# Altium project casio.PrjPcb
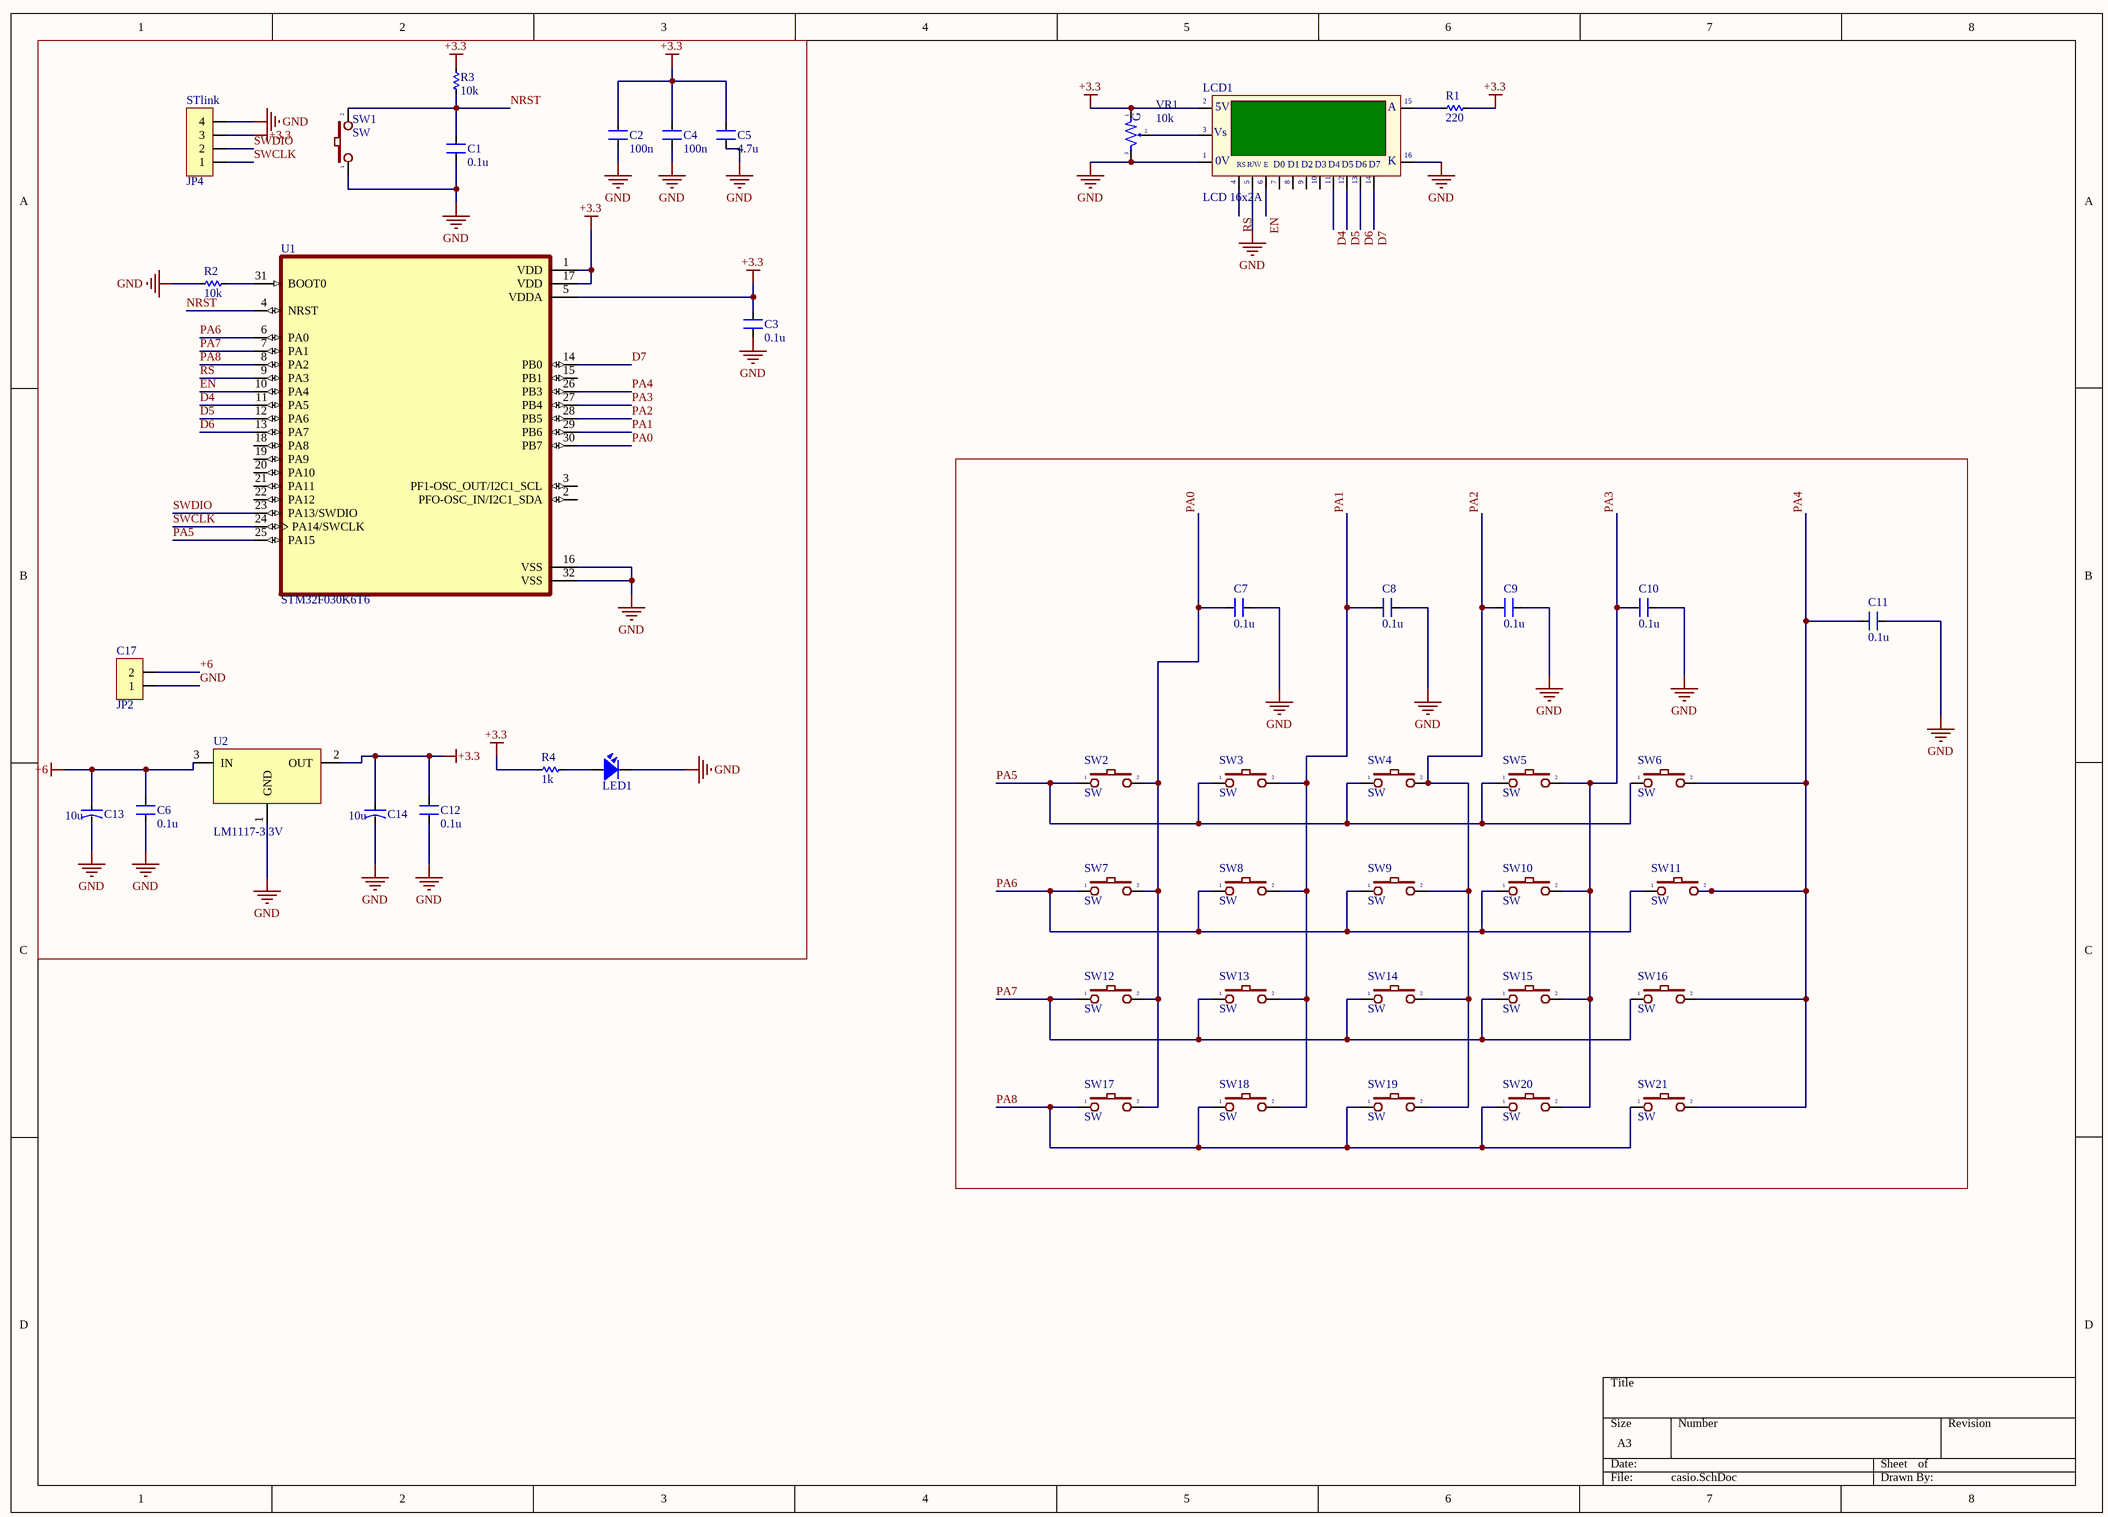
[diagram p0: casio.SchDoc]
1 sheet, 46 parts. Net scope: global (net labels, ports and power ports of the same name join across sheets).
Board file: casio_final.PcbDoc

## Sheet casio.SchDoc
size A3; SheetNumber: 1; SheetTotal: 1

### Parts
C1  0.1u  [CN-SMD-0805]
C2  100n  [CN-SMD-0805]
C3  0.1u  [CN-SMD-0805]
C4  100n  [CN-SMD-0805]
C5  4.7u  [CN-SMD-0805]
C6  0.1u  [CN-SMD-0805]
C7  0.1u  [CN-SMD-0805]
C8  0.1u  [CN-SMD-0805]
C9  0.1u  [CN-SMD-0805]
C10  0.1u  [CN-SMD-0805]
C11  0.1u  [CN-SMD-0805]
C12  0.1u  [CN-SMD-0805]
C13  10u  [CAP-ALU-SMD-5.5x5.5]
C14  10u  [CAP-ALU-SMD-5.5x5.5]
C17  JP2  [JP2-D1T]
LCD1  LCD 16x2A  [LCD16X2]
LED1  LED  [LED-0805-Red]  (value not drawn)
R1  220  [RES-SMD-0805]
R2  10k  [RES-SMD-0805]
R3  10k  [RES-SMD-0805]
R4  1k  [RES-SMD-0805]
STlink  JP4  [JP4-C1T]
SW1  SW  [SW1-SMD]
SW2  SW  [SW1-DIP-12x12x8-Black]
SW3  SW  [SW1-DIP-12x12x8-Black]
SW4  SW  [SW1-DIP-12x12x8-Black]
SW5  SW  [SW1-DIP-12x12x8-Black]
SW6  SW  [SW1-DIP-12x12x8-Black]
SW7  SW  [SW1-DIP-12x12x8-Black]
SW8  SW  [SW1-DIP-12x12x8-Black]
SW9  SW  [SW1-DIP-12x12x8-Black]
SW10  SW  [SW1-DIP-12x12x8-Black]
SW11  SW  [SW1-DIP-12x12x8-Black]
SW12  SW  [SW1-DIP-12x12x8-Black]
SW13  SW  [SW1-DIP-12x12x8-Black]
SW14  SW  [SW1-DIP-12x12x8-Black]
SW15  SW  [SW1-DIP-12x12x8-Black]
SW16  SW  [SW1-DIP-12x12x8-Black]
SW17  SW  [SW1-DIP-12x12x8-Black]
SW18  SW  [SW1-DIP-12x12x8-Black]
SW19  SW  [SW1-DIP-12x12x8-Black]
SW20  SW  [SW1-DIP-12x12x8-Black]
SW21  SW  [SW1-DIP-12x12x8-Black]
U1  STM32F030K6T6  [QFP80P900X900X160-32N]
U2  LM1117-3.3V  [SOT223]
VR1  10k  [VR-S2]

### Nets
+3.3: C2.1 C3.1 C4.1 C5.1 C12.1 C14.1 LCD1.2(VDD) R1.1 R3.2 R4.2 STlink.3 U1.1(VDD) U1.5(VDDA) U1.17(VDD) U2.2(OUT) VR1.1
+6: C6.1 C13.1 C17.2 U2.3(IN)
GND: C1.2 C2.2 C3.2 C4.2 C5.2 C6.2 C7.2 C8.2 C9.2 C10.2 C11.2 C12.2 C13.2 C14.2 C17.1 LCD1.1(GND) LCD1.5(R/~{W}) LCD1.16(K) LED1.2 R2.2 STlink.4 SW1.1 U1.16(VSS) U1.32(VSS) U2.1(GND) VR1.3
D4: LCD1.11(D4) U1.11(PA5)
D5: LCD1.12(D5) U1.12(PA6)
D6: LCD1.13(D6) U1.13(PA7)
D7: LCD1.14(D7) U1.14(PB0)
EN: LCD1.6(~{EN}) U1.10(PA4)
NRST: C1.1 R3.1 SW1.2 U1.4(NRST)
PA0: C7.1 SW2.2 SW7.2 SW12.2 SW17.2 U1.30(PB7)
PA1: C8.1 SW3.2 SW8.2 SW13.2 SW18.2 U1.29(PB6)
PA2: C9.1 SW4.2 SW9.2 SW14.2 SW19.2 U1.28(PB5)
PA3: C10.1 SW5.2 SW10.2 SW15.2 SW20.2 U1.27(PB4)
PA4: C11.1 SW6.2 SW11.2 SW16.2 SW21.2 U1.26(PB3)
PA5: SW2.1 SW3.1 SW4.1 SW5.1 SW6.1 U1.25(PA15)
PA6: SW7.1 SW8.1 SW9.1 SW10.1 SW11.1 U1.6(PA0)
PA7: SW12.1 SW13.1 SW14.1 SW15.1 SW16.1 U1.7(PA1)
PA8: SW17.1 SW18.1 SW19.1 SW20.1 SW21.1 U1.8(PA2)
RS: LCD1.4(RS) U1.9(PA3)
SWCLK: STlink.1 U1.24(PA14/SWCLK)
SWDIO: STlink.2 U1.23(PA13/SWDIO)
NetLCD1_3: LCD1.3(VEE) VR1.2
NetLCD1_15: LCD1.15(A) R1.2
NetLED1_1: LED1.1 R4.1
NetR2_1: R2.1 U1.31(BOOT0)

Not connected (* = marked no-connect by the designer): LCD1 7(D0) 8(D1) 9(D2) 10(D3); U1 2(PFO-OSC_IN/I2C1_SDA) 3(PF1-OSC_OUT/I2C1_SCL) 15(PB1) 18(PA8) 19(PA9) 20(PA10) 21(PA11) 22(PA12)

### Notes on the sheet
- (in symbol LCD16x2A) 5V; Vs; |; 0V; R/W; E
- (in symbol VR-S) G

### Library data of the parts
C1-C12 = CN: Value: 33pF
C13 C14 = CN-SMD: Polarized Capacitor (Axial); Published: 8-Jun-2000; LatestRevisionDate: 17-Jul-2002; LatestRevisionNote: Re-released for DXP Platform.; PackageReference: POLAR0.8; Publisher: Altium Limited
C17 = JP2: WR-PHD 2.54 mm Angled Socket Header; Manufacturer: W¨¹rth Elektronik eiSos GmbH; partNo: 613002143121; ComponentLink1 Description: Manufacturer; ComponentLink2 Description: Datasheet; NoPins: 02; Created Date: 29 March 2013; ComponentLink1URL: http://www.we-online.com; ComponentLink2URL: http://katalog.we-online.de/em/datasheet/6130xx143121.pdf; Created by: Karrer Zheng
LCD1 = LCD16x2A: LCD dipslay 16 char, 2 line; Value: LCD16x2A
LED1 = LED SMD: Value: LED 3 - 5 ly 2 Colour
R1-R4 = Res-SMD: Resistor; Manufacturer: Generic Components; Class: Passive; Published: 08/06/2000; Publisher: Altium Hobart Technology Centre
STlink = JP4: WR-PHD 2.54 mm Angled Socket Header; Manufacturer: W¨¹rth Elektronik eiSos GmbH; partNo: 613004143121; ComponentLink1 Description: Manufacturer; ComponentLink2 Description: Datasheet; NoPins: 04; Created Date: 29 March 2013; ComponentLink1URL: http://www.we-online.com; ComponentLink2URL: http://katalog.we-online.de/em/datasheet/6130xx143121.pdf; Created by: Karrer Zheng
SW1-SW21 = SW2: Switch button 2 pin; Value: SW chip 2 pin
U1 = STM32F030K6T6: ARMÂ® CortexÂ®-M0 STM32F0 Microcontroller IC 32-Bit Single-Core 48MHz 32KB (32K x 8) FLASH 32-LQFP (7x7); MF: STMicroelectronics; Check_prices: https://www.snapeda.com/parts/STM32F030K6T6/STMicroelectronics/view-part/?ref=eda; Digi-Key_Part_Number: 497-14046-ND; Package: LQFP-32 STMicroelectronics; MP: STM32F030K6T6; Value: *; SnapEDA_Link: https://www.snapeda.com/parts/STM32F030K6T6/STMicroelectronics/view-part/?ref=snap; Purchase-URL: https://pricing.snapeda.com/search/part/STM32F030K6T6/?ref=eda
U2 = LM1117: 800mA Low-Dropout Linear Regulator; Creator: Nguyen Ba Bien; Website: http://group3i.net
VR1 = VR-S: Var Resistor; Value: Volume 50k